# EAGLE schematic stm32_hakko_old (EAGLE 9.2.0)
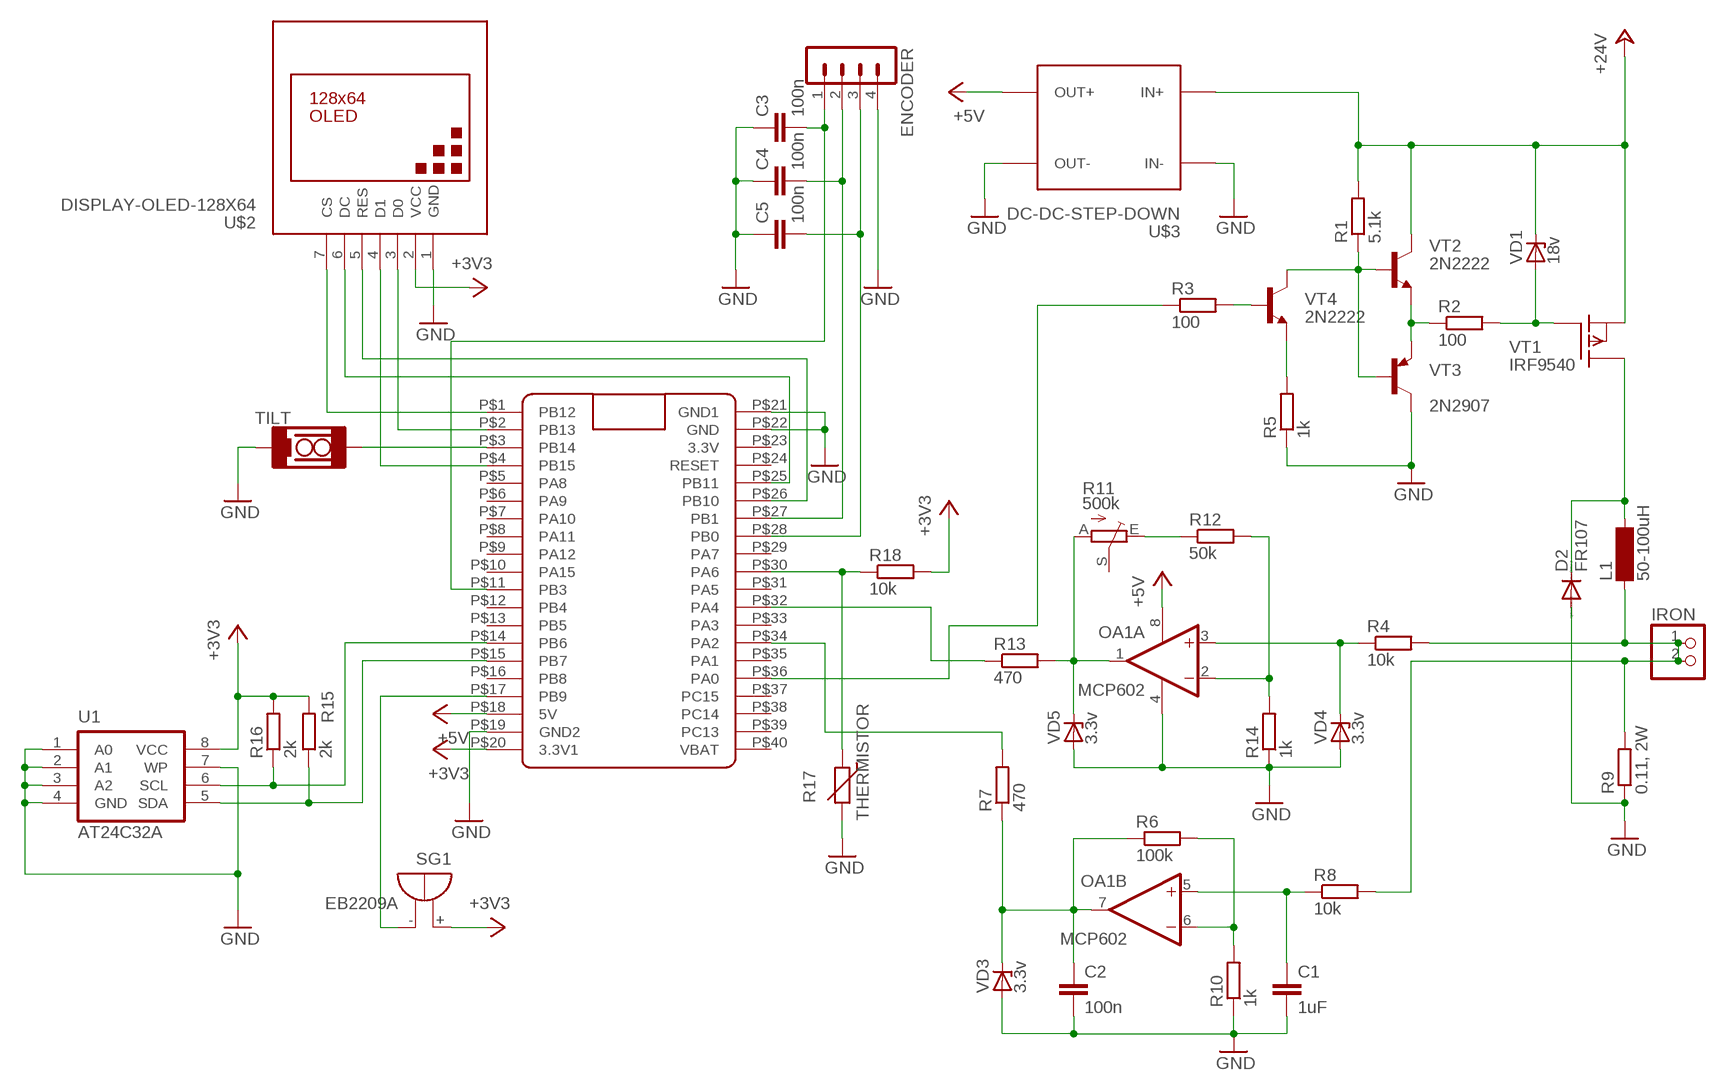
[diagram p0: schematic, sheet 1]

## Parts
C1  1uF  C-EU025-025X050  [C025-025X050]
C2  100n  C-EU025-025X050  [C025-025X050]
C3  100n  C-EU025-025X050  [C025-025X050]
C4  100n  C-EU025-025X050  [C025-025X050]
C5  100n  C-EU025-025X050  [C025-025X050]
D2  FR107  1N4004  [DO41-10]
ENCODER  MA04-1  [MA04-1]
IRON  PINHD-1X2  [1X02]
L1  50-100uH  SD12K100  [SD12K100]
OA1  MCP602  MCP602SN  [SO08]
R1  5.1k  R-EU_0204/5  [0204/5]
R2  100  R-EU_0204/5  [0204/5]
R3  100  R-EU_0204/5  [0204/5]
R4  10k  R-EU_0204/5  [0204/5]
R5  1k  R-EU_0204/5  [0204/5]
R6  100k  R-EU_0204/5  [0204/5]
R7  470  R-EU_0204/5  [0204/5]
R8  10k  R-EU_0204/5  [0204/5]
R9  0.11, 2W  R-EU_0204/5  [0204/5]
R10  1k  R-EU_0204/5  [0204/5]
R11  500k  TRIM_EU-RJ9W  [RJ9W]
R12  50k  R-EU_0204/5  [0204/5]
R13  470  R-EU_0204/5  [0204/5]
R14  1k  R-EU_0204/5  [0204/5]
R15  2k  R-EU_0204/5  [0204/5]
R16  2k  R-EU_0204/5  [0204/5]
R17  THERMISTOR  THERMISTOR-2,5  [RS-2,5]
R18  10k  R-EU_0204/5  [0204/5]
SG1  EB2209A  [EB2209A]
TILT  SQ-SEN-200  [SQ-SEN-200]
U1  AT24C32A  AT24CXX-8S1  [SO08-8S1]
U$1  BLUE_PILL  [BLUE_PILL]
U$2  DISPLAY-OLED-128X64  [DISPLAY-OLED-128X64]
U$3  DC-DC-STEP-DOWN  DC-DC-STEP-DOWN-MP2307  [DC-DC-STEP-DOWN-MP2307]
VD1  18v  ZENER-DIODEDO34-7  [DO34Z7]
VD3  3.3v  ZENER-DIODEDO34-7  [DO34Z7]
VD4  3.3v  ZENER-DIODEDO34-7  [DO34Z7]
VD5  3.3v  ZENER-DIODEDO34-7  [DO34Z7]
VT1  IRF9540  IRF9530  [TO220]
VT2  2N2222  [TO18]
VT3  2N2907  [TO18]
VT4  2N2222  [TO18]

## Nets
+3V3: OA1.4(P:V-) R14.1 R15.2 R16.2 R18.2 SG1.+ U1.8(VCC) U$1.P$20(3.3V1) U$2.2(VCC) VD4.A VD5.A ; supply symbol labelled GND
+5V: OA1.8(P:V+) U$1.P$18(5V) U$3.OUT+
+24V: R1.2 U$3.IN+ VD1.C VT1.3(S) VT2.3(C)
GND: C1.2 C2.2 C3.1 C4.1 C5.1 D2.A ENCODER.4 R5.1 R9.1 R10.1 R17.2 TILT.1 U1.1(A0) U1.2(A1) U1.3(A2) U1.4(GND) U1.7(WP) U$1.P$19(GND2) U$1.P$21(GND1) U$1.P$22(GND) U$2.1(GND) U$3.IN- U$3.OUT- VD3.A VT3.3(C)
N$1: R15.1 U1.5(SDA) U$1.P$15(PB7)
N$2: R16.1 U1.6(SCL) U$1.P$14(PB6)
N$3: U$1.P$1(PB12) U$2.7(CS)
N$4: U$1.P$25(PB11) U$2.6(DC)
N$5: U$1.P$26(PB10) U$2.5(RES)
N$6: U$1.P$4(PB15) U$2.4(D1)
N$7: U$1.P$2(PB13) U$2.3(D0)
N$8: SG1.- U$1.P$17(PB9)
N$9: C5.2 ENCODER.3 U$1.P$28(PB0)
N$10: C4.2 ENCODER.2 U$1.P$27(PB1)
N$11: C3.2 ENCODER.1 U$1.P$11(PB3)
N$12: R11.E R12.1
N$13: R13.1 U$1.P$32(PA4)
N$14: OA1.2(A:-IN) R12.2 R14.2
N$15: OA1.3(A:+IN) R4.1 VD4.C
N$16: IRON.1 IRON.2 L1.1 R4.2 R8.2 R9.2
N$17: D2.C L1.2 VT1.2(D)
N$18: C2.1 OA1.7(B:OUT) R6.1 R7.1 VD3.C
N$19: OA1.6(B:-IN) R6.2 R10.2
N$20: OA1.1(A:OUT) R11.A R13.2 VD5.C
N$21: R7.2 U$1.P$34(PA2)
N$22: C1.1 OA1.5(B:+IN) R8.1
N$23: R2.2 VD1.A VT1.1(G)
N$24: R2.1 VT2.1(E) VT3.1(E)
N$25: R1.1 VT2.2(B) VT3.2(B) VT4.3(C)
N$26: R5.2 VT4.1(E)
N$27: R3.2 VT4.2(B)
N$28: R3.1 U$1.P$36(PA0)
N$29: R17.1 R18.1 U$1.P$30(PA6)
N$30: TILT.2 U$1.P$3(PB14)
Unconnected: R11.S U$1.P$5(PA8) U$1.P$6(PA9) U$1.P$7(PA10) U$1.P$8(PA11) U$1.P$9(PA12) U$1.P$10(PA15) U$1.P$12(PB4) U$1.P$13(PB5) U$1.P$16(PB8) U$1.P$23(3.3V) U$1.P$24(RESET) U$1.P$29(PA7) U$1.P$31(PA5) U$1.P$33(PA3) U$1.P$35(PA1) U$1.P$37(PC15) U$1.P$38(PC14) U$1.P$39(PC13) U$1.P$40(VBAT)

## Library data of the parts
C1-C5 = rcl:C-EU: CAPACITOR, European symbol; SPICEPREFIX: C
D2 = diode:1N4004: DIODE general purpose rectifier, 1 A
ENCODER = con-lstb:MA04-1: PIN HEADER; OC_FARNELL: unknown; OC_NEWARK: unknown
IRON = pinhead:PINHD-1X2: PIN HEADER
L1 = inductor-neosid:SD12: INDUCTOR nominal inductance; OC_FARNELL: unknown; OC_NEWARK: unknown
OA1 = linear:MCP602: Single Op Amp 2.7V to 6.0V Single Supply CMOS Source: http://ww1.microchip.com/downloads/en/DeviceDoc/21314g.pdf
R1-R10 R12-R16 R18 = rcl:R-EU_: RESISTOR, European symbol; SPICEPREFIX: R
R11 = pot:TRIM_EU-: POTENTIOMETER
R17 = varistor:THERMISTOR: THERMISTOR
SG1 = buzzer:EB2209A: BUZZER Source: Buerklin; OC_FARNELL: unknown; OC_NEWARK: unknown
TILT = sensor-signalquest:SQ-SEN-200: TILT AND VIBRATION SENSOR OMNIDIRECTIONAL
U1 = memory-atmel:AT24CXX: EEPROM I2C serial bus
U$1 = BluePill:BLUE_PILL
U$2 = diy-modules:DISPLAY-OLED-128X64: 128x64 Dot Matrix OLED Module based on SSD1306 chip Variant with SPI interface More details available here: http://www.instructables.com/id/How-to-use-OLED-display-arduino-module/ SSD1306 datasheet: https://cdn-shop.adafruit.com/datasheets/SSD1306.pdf Click here to find device on ebay.com <http://www.ebay.com/sch/oled+display+128x64> Note: There are two variants: I2C and SPI. Search for the proper version.
U$3 = diy-modules:DC-DC-STEP-DOWN-MP2307: DC/DC Step-Down Regulator based on MP2307DN chip MP2307 datasheet available here: https://cdn-shop.adafruit.com/datasheets/MP2307_r1.9.pdf Click here to find device on ebay.com <http://www.ebay.com/sch/dc+dc+3a+mini+converter>
VD1 VD3-VD5 = diode:ZENER-DIODE: Z-Diode
VT1 = transistor-fet:IRF9530: P-Channel Enhancement MOSFET (HEXFET); -100V; -12A; 0,3Ohm
VT2 VT4 = transistor:2N2222: NPN TRANSISTOR
VT3 = transistor-pnp:2N2907*: PNP Transistor